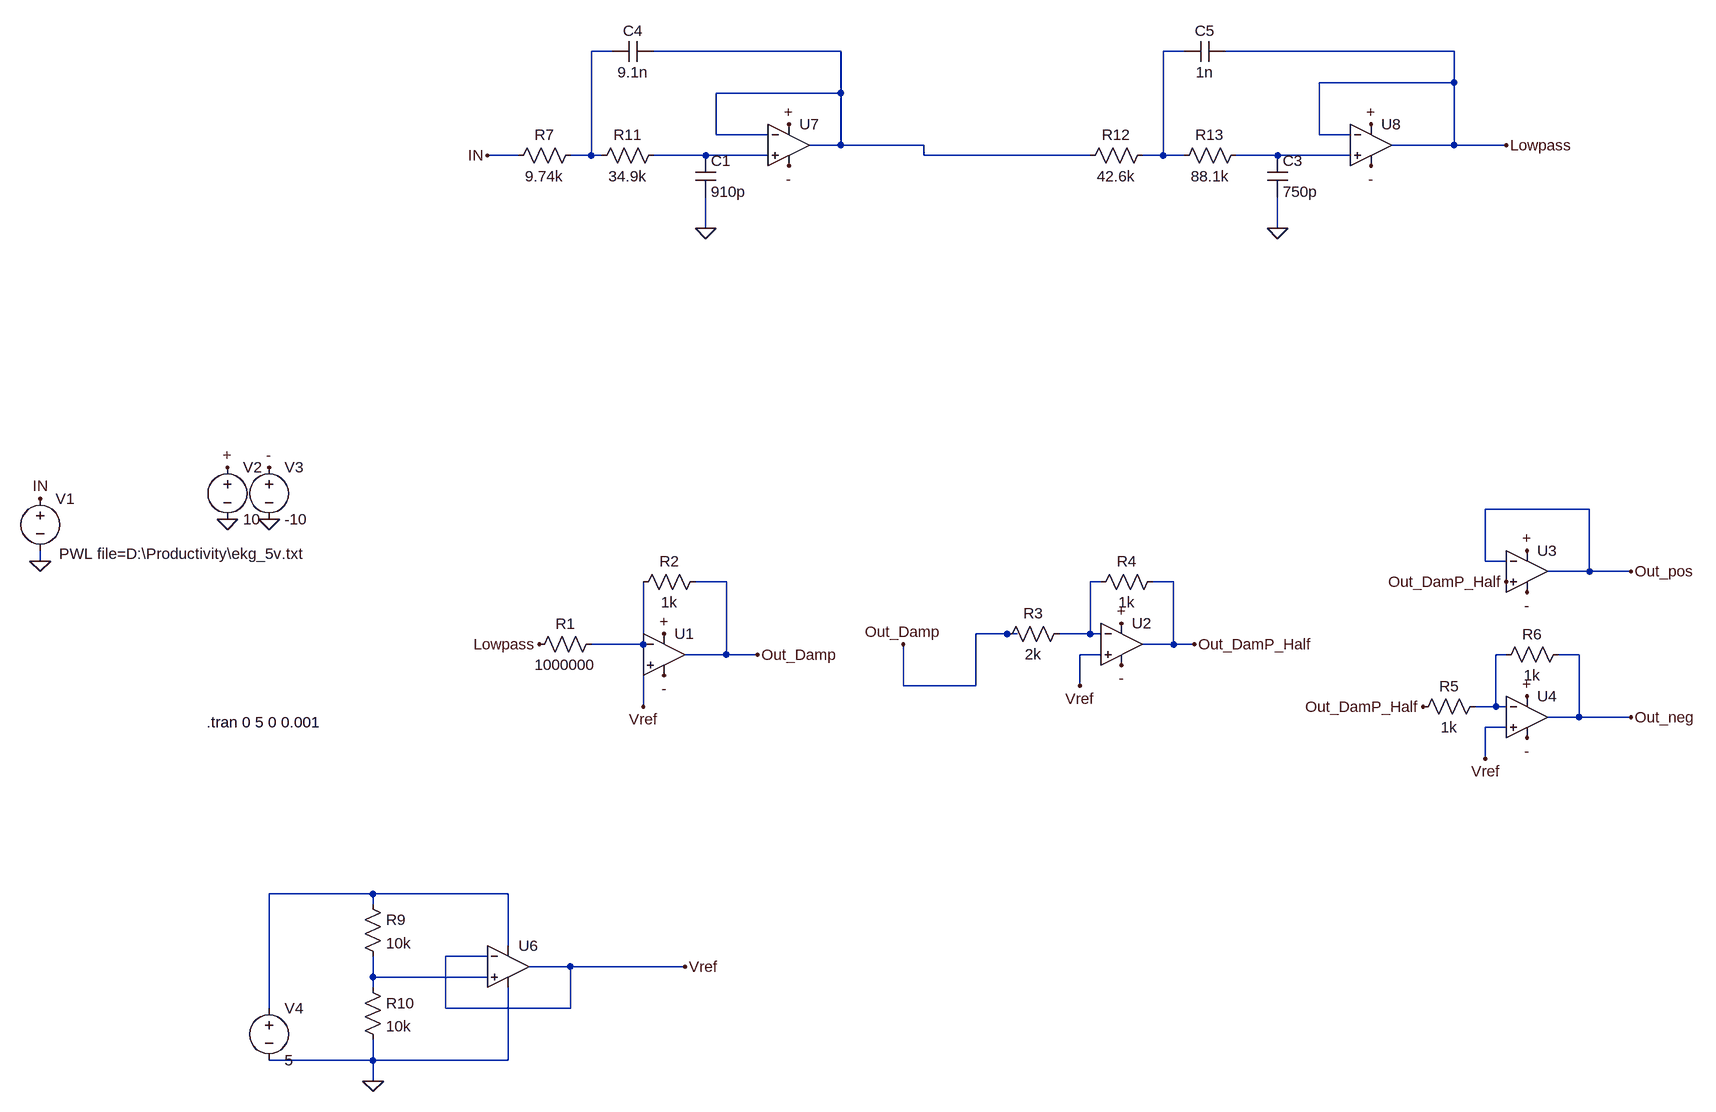
[diagram p0: schematic EKG_Simulation_OPV_Analog.asc]
EKG_Simulation_OPV_Analog.asc, the LTspice schematic file:
Version 4
SHEET 1 2644 884
WIRE 224 -768 192 -768
WIRE 576 -768 288 -768
WIRE 1104 -768 1072 -768
WIRE 1520 -768 1168 -768
WIRE 1520 -720 1520 -768
WIRE 1520 -720 1312 -720
WIRE 576 -704 576 -768
WIRE 576 -704 384 -704
WIRE 384 -640 384 -704
WIRE 464 -640 384 -640
WIRE 1312 -640 1312 -720
WIRE 1360 -640 1312 -640
WIRE 576 -624 576 -704
WIRE 576 -624 528 -624
WIRE 704 -624 576 -624
WIRE 1520 -624 1520 -720
WIRE 1520 -624 1424 -624
WIRE 1600 -624 1520 -624
WIRE 80 -608 32 -608
WIRE 192 -608 192 -768
WIRE 192 -608 160 -608
WIRE 208 -608 192 -608
WIRE 368 -608 288 -608
WIRE 464 -608 368 -608
WIRE 704 -608 704 -624
WIRE 960 -608 704 -608
WIRE 1072 -608 1072 -768
WIRE 1072 -608 1040 -608
WIRE 1104 -608 1072 -608
WIRE 1248 -608 1184 -608
WIRE 1360 -608 1248 -608
WIRE 368 -496 368 -544
WIRE 1248 -496 1248 -544
WIRE 1728 -64 1568 -64
WIRE -656 16 -656 0
WIRE 1568 16 1568 -64
WIRE 1600 16 1568 16
WIRE 1728 32 1728 -64
WIRE 1728 32 1664 32
WIRE 1792 32 1728 32
WIRE 400 48 352 48
WIRE 976 48 960 48
WIRE 1088 48 1056 48
WIRE 832 128 784 128
WIRE 848 128 832 128
WIRE 960 128 960 48
WIRE 960 128 912 128
WIRE 976 128 960 128
WIRE 272 144 272 48
WIRE 272 144 192 144
WIRE 1088 144 1088 48
WIRE 1088 144 1040 144
WIRE 1120 144 1088 144
WIRE 400 160 400 48
WIRE 400 160 336 160
WIRE 448 160 400 160
WIRE 976 160 944 160
WIRE 1600 160 1584 160
WIRE 1712 160 1680 160
WIRE 672 208 672 144
WIRE 784 208 784 128
WIRE 784 208 672 208
WIRE 944 208 944 160
WIRE 272 240 272 176
WIRE 1584 240 1584 160
WIRE 1584 240 1552 240
WIRE 1600 240 1584 240
WIRE 1712 256 1712 160
WIRE 1712 256 1664 256
WIRE 1792 256 1712 256
WIRE 1600 272 1568 272
WIRE 1568 320 1568 272
WIRE -144 528 -304 528
WIRE 64 528 -144 528
WIRE -144 544 -144 528
WIRE 64 608 64 528
WIRE 32 624 -32 624
WIRE 160 640 96 640
WIRE 336 640 160 640
WIRE -144 656 -144 624
WIRE 32 656 -144 656
WIRE -144 672 -144 656
WIRE -304 704 -304 528
WIRE -32 704 -32 624
WIRE 160 704 160 640
WIRE 160 704 -32 704
WIRE -144 784 -144 752
WIRE -144 784 -304 784
WIRE 64 784 64 672
WIRE 64 784 -144 784
WIRE -144 816 -144 784
FLAG -656 16 0
FLAG -304 -48 0
FLAG -368 -48 0
FLAG -368 -128 +
FLAG 304 128 +
FLAG -304 -128 -
FLAG 304 192 -
FLAG 448 160 Out_Damp
FLAG 672 144 Out_Damp
FLAG 1120 144 Out_DamP_Half
FLAG 1600 48 Out_DamP_Half
FLAG 1472 240 Out_DamP_Half
FLAG 1008 112 +
FLAG 1632 0 +
FLAG 1632 224 +
FLAG 1008 176 -
FLAG 1632 288 -
FLAG 1632 64 -
FLAG 1792 32 Out_pos
FLAG 1792 256 Out_neg
FLAG -656 -80 IN
FLAG 112 144 Lowpass
FLAG 336 640 Vref
FLAG 944 208 Vref
FLAG 272 240 Vref
FLAG 1568 320 Vref
FLAG 368 -496 0
FLAG 1248 -496 0
FLAG 32 -608 IN
FLAG 1392 -656 +
FLAG 496 -656 +
FLAG 1392 -592 -
FLAG 496 -592 -
FLAG 1600 -624 Lowpass
FLAG -144 816 0
SYMBOL OpAmps\\UniversalOpAmp2 304 160 R0
SYMATTR InstName U1
SYMBOL res 208 128 R90
WINDOW 0 0 56 VBottom 2
WINDOW 3 32 56 VTop 2
SYMATTR InstName R1
SYMATTR Value 1000000
SYMBOL res 368 32 R90
WINDOW 0 0 56 VBottom 2
WINDOW 3 32 56 VTop 2
SYMATTR InstName R2
SYMATTR Value 1k
SYMBOL voltage -656 -96 R0
WINDOW 123 0 0 Left 0
WINDOW 39 0 0 Left 0
WINDOW 3 29 101 Left 2
SYMATTR Value PWL file=D:\Productivity\ekg_5v.txt
SYMATTR InstName V1
SYMBOL voltage -368 -144 R0
WINDOW 123 0 0 Left 0
WINDOW 39 0 0 Left 0
SYMATTR InstName V2
SYMATTR Value 10
SYMBOL voltage -304 -144 R0
WINDOW 123 0 0 Left 0
WINDOW 39 0 0 Left 0
SYMATTR InstName V3
SYMATTR Value -10
SYMBOL OpAmps\\UniversalOpAmp2 1008 144 R0
SYMATTR InstName U2
SYMBOL OpAmps\\UniversalOpAmp2 1632 32 R0
SYMATTR InstName U3
SYMBOL OpAmps\\UniversalOpAmp2 1632 256 R0
SYMATTR InstName U4
SYMBOL res 928 112 R90
WINDOW 0 0 56 VBottom 2
WINDOW 3 32 56 VTop 2
SYMATTR InstName R3
SYMATTR Value 2k
SYMBOL res 1072 32 R90
WINDOW 0 0 56 VBottom 2
WINDOW 3 32 56 VTop 2
SYMATTR InstName R4
SYMATTR Value 1k
SYMBOL res 1568 224 R90
WINDOW 0 0 56 VBottom 2
WINDOW 3 32 56 VTop 2
SYMATTR InstName R5
SYMATTR Value 1k
SYMBOL res 1696 144 R90
WINDOW 0 0 56 VBottom 2
WINDOW 3 32 56 VTop 2
SYMATTR InstName R6
SYMATTR Value 1k
SYMBOL OpAmps\\UniversalOpAmp2 64 640 R0
SYMATTR InstName U6
SYMBOL voltage -304 688 R0
WINDOW 123 0 0 Left 0
WINDOW 39 0 0 Left 0
SYMATTR InstName V4
SYMATTR Value 5
SYMBOL res -160 528 R0
SYMATTR InstName R9
SYMATTR Value 10k
SYMBOL res -160 656 R0
SYMATTR InstName R10
SYMATTR Value 10k
SYMBOL res 176 -624 R90
WINDOW 0 0 56 VBottom 2
WINDOW 3 32 56 VTop 2
SYMATTR InstName R7
SYMATTR Value 9.74k
SYMBOL res 304 -624 R90
WINDOW 0 0 56 VBottom 2
WINDOW 3 32 56 VTop 2
SYMATTR InstName R11
SYMATTR Value 34.9k
SYMBOL res 1056 -624 R90
WINDOW 0 0 56 VBottom 2
WINDOW 3 32 56 VTop 2
SYMATTR InstName R12
SYMATTR Value 42.6k
SYMBOL res 1200 -624 R90
WINDOW 0 0 56 VBottom 2
WINDOW 3 32 56 VTop 2
SYMATTR InstName R13
SYMATTR Value 88.1k
SYMBOL cap 352 -608 R0
SYMATTR InstName C1
SYMATTR Value 910p
SYMBOL cap 1232 -608 R0
SYMATTR InstName C3
SYMATTR Value 750p
SYMBOL cap 288 -784 R90
WINDOW 0 0 32 VBottom 2
WINDOW 3 32 32 VTop 2
SYMATTR InstName C4
SYMATTR Value 9.1n
SYMBOL cap 1168 -784 R90
WINDOW 0 0 32 VBottom 2
WINDOW 3 32 32 VTop 2
SYMATTR InstName C5
SYMATTR Value 1n
SYMBOL OpAmps\\UniversalOpAmp2 496 -624 R0
SYMATTR InstName U7
SYMBOL OpAmps\\UniversalOpAmp2 1392 -624 R0
SYMATTR InstName U8
TEXT -400 264 Left 2 !.tran 0 5 0 0.001

The netlist it stands for:
* EKG_Simulation_OPV_Analog.asc
XU1 Vref N007 + - Out_Damp level2 Avol=1Meg GBW=10Meg Slew=10Meg Ilimit=25m Rail=0 Vos=0 En=0 Enk=0 In=0 Ink=0 Rin=500Meg  ; pins In+ In- V+ V- OUT
R1 N007 Lowpass 1000000
R2 Out_Damp N007 1k
V1 IN 0 PWL file=D:\Productivity\ekg_5v.txt
V2 + 0 10
V3 - 0 -10
XU2 Vref N006 + - Out_DamP_Half level2 Avol=1Meg GBW=10Meg Slew=10Meg Ilimit=25m Rail=0 Vos=0 En=0 Enk=0 In=0 Ink=0 Rin=500Meg  ; pins In+ In- V+ V- OUT
XU3 Out_DamP_Half Out_pos + - Out_pos level2 Avol=1Meg GBW=10Meg Slew=10Meg Ilimit=25m Rail=0 Vos=0 En=0 Enk=0 In=0 Ink=0 Rin=500Meg  ; pins In+ In- V+ V- OUT
XU4 Vref N008 + - Out_neg level2 Avol=1Meg GBW=10Meg Slew=10Meg Ilimit=25m Rail=0 Vos=0 En=0 Enk=0 In=0 Ink=0 Rin=500Meg  ; pins In+ In- V+ V- OUT
R3 N006 Out_Damp 2k
R4 Out_DamP_Half N006 1k
R5 N008 Out_DamP_Half 1k
R6 Out_neg N008 1k
XU6 N010 Vref N009 0 Vref level2 Avol=1Meg GBW=10Meg Slew=10Meg Ilimit=25m Rail=0 Vos=0 En=0 Enk=0 In=0 Ink=0 Rin=500Meg  ; pins In+ In- V+ V- OUT
V4 N009 0 5
R9 N009 N010 10k
R10 N010 0 10k
R7 N001 IN 9.74k
R11 N004 N001 34.9k
R12 N003 N002 42.6k
R13 N005 N003 88.1k
C1 N004 0 910p
C3 N005 0 750p
C4 N002 N001 9.1n
C5 Lowpass N003 1n
XU7 N004 N002 + - N002 level2 Avol=1Meg GBW=10Meg Slew=10Meg Ilimit=25m Rail=0 Vos=0 En=0 Enk=0 In=0 Ink=0 Rin=500Meg  ; pins In+ In- V+ V- OUT
XU8 N005 Lowpass + - Lowpass level2 Avol=1Meg GBW=10Meg Slew=10Meg Ilimit=25m Rail=0 Vos=0 En=0 Enk=0 In=0 Ink=0 Rin=500Meg  ; pins In+ In- V+ V- OUT
.tran 0 5 0 0.001
.lib UniversalOpAmp2.lib
.backanno
.end